# Altium schematic sheet STM 32 F4 sensor_motor.SchDoc
size A3
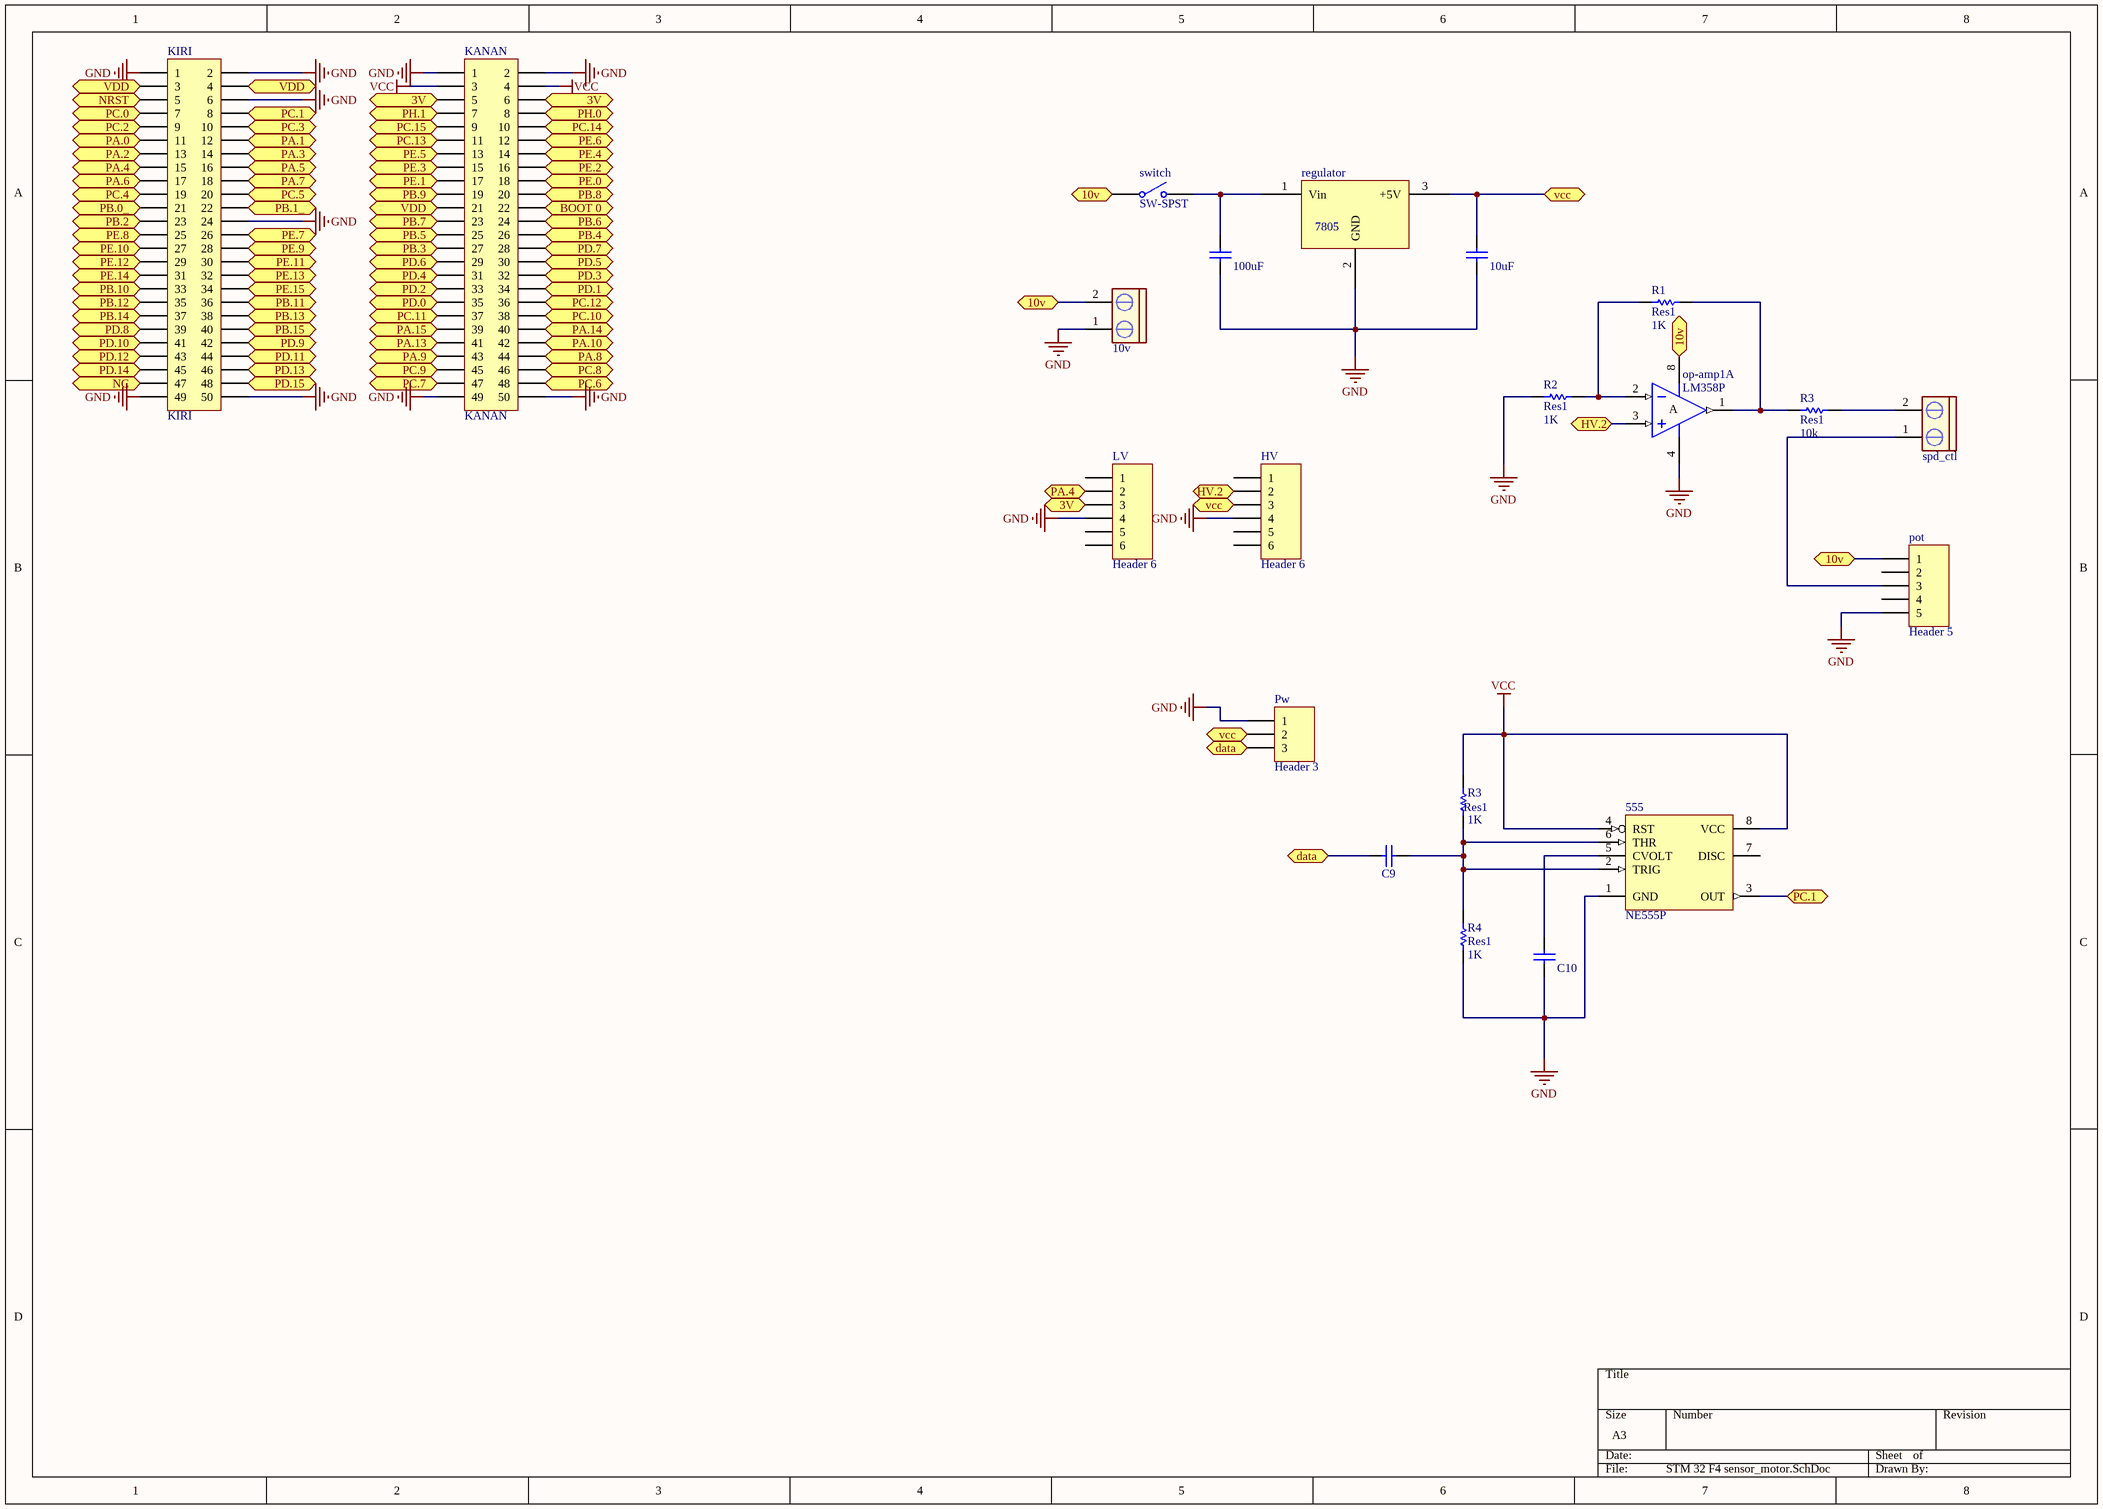
[diagram p0: STM 32 F4 sensor_motor.SchDoc]

## Parts
(Parts that share a designator on the sheet are numbered #1, #2 ... from top to bottom, then left to right.)
10uF  Cap  [My_cap100n]  (value not drawn)
10v  CON2 pin blue  [My_CN2]  (value not drawn)
100uF  Cap  [My_cap100n]  (value not drawn)
555  NE555P  [P008]
C9  Cap  [My_cap100n]  (value not drawn)
C10  Cap  [My_cap100n]  (value not drawn)
HV  Header 6  [HDR1X6]
KANAN  KANAN  [HDR2X25]
KIRI  KIRI  [HDR2X25]
LV  Header 6  [HDR1X6]
op-amp1  LM358P  [P008]  (part A of 2)
pot  Header 5  [HDR1X5]
Pw  Header 3  [HDR1X3]
R1  Res1  value 1K  [AXIAL-0.3]
R2  Res1  value 1K  [AXIAL-0.3]
R3#1  Res1  value 10k  [AXIAL-0.3]
R3#2  Res1  value 1K  [AXIAL-0.3]
R4  Res1  value 1K  [AXIAL-0.3]
regulator  7805  [My_TO-220]
spd_ctl  CON2 pin blue  [My_CN2]  (value not drawn)
switch  SW-SPST  [SPST-2]

## Ports
3V, 10v, BOOT 0, data, HV.2, NC, NRST, PA.0, PA.1, PA.2, PA.3, PA.4, PA.5, PA.6, PA.7, PA.8, PA.9, PA.10, PA.13, PA.14, PA.15, PB.0_, PB.1_, PB.2, PB.3, PB.4, PB.5, PB.6, PB.7, PB.8, PB.9, PB.10, PB.11, PB.12, PB.13, PB.14, PB.15, PC.0, PC.1, PC.2, PC.3, PC.4, PC.5, PC.6, PC.7, PC.8, PC.9, PC.10, PC.11, PC.12, PC.13, PC.14, PC.15, PD.0, PD.1, PD.2, PD.3, PD.4, PD.5, PD.6, PD.7, PD.8, PD.9, PD.10, PD.11, PD.12, PD.13, PD.14, PD.15, PE.0, PE.1, PE.2, PE.3, PE.4, PE.5, PE.6, PE.7, PE.8, PE.9, PE.10, PE.11, PE.12, PE.13, PE.14, PE.15, PH.0, PH.1, vcc, VDD

## Nets
GND: 10uF.1 10v.1 100uF.1 555.1(GND) C10.1 HV.4 KANAN.1 KANAN.2 KANAN.49 KANAN.50 KIRI.1 KIRI.2 KIRI.6 KIRI.24 KIRI.49 KIRI.50 LV.4 op-amp1.4(V-) pot.5 Pw.1 R2.1 R4.1 regulator.2(GND)
VCC: 555.4(RST) 555.8(VCC) KANAN.3 KANAN.4 R3#2.2
3V: KANAN.5 KANAN.6 LV.3 ; port 3V
10v: 10v.2 op-amp1.8(V+) pot.1 switch.1(COMMON) ; port 10v
BOOT 0: KANAN.22 ; port BOOT 0
data: C9.1 Pw.3 ; port data
HV.2: HV.2 op-amp1.3(IN+) ; port HV.2
NC: KIRI.47 ; port NC
NRST: KIRI.5 ; port NRST
PA.0: KIRI.11 ; port PA.0
PA.1: KIRI.12 ; port PA.1
PA.2: KIRI.13 ; port PA.2
PA.3: KIRI.14 ; port PA.3
PA.4: KIRI.15 LV.2 ; port PA.4
PA.5: KIRI.16 ; port PA.5
PA.6: KIRI.17 ; port PA.6
PA.7: KIRI.18 ; port PA.7
PA.8: KANAN.44 ; port PA.8
PA.9: KANAN.43 ; port PA.9
PA.10: KANAN.42 ; port PA.10
PA.13: KANAN.41 ; port PA.13
PA.14: KANAN.40 ; port PA.14
PA.15: KANAN.39 ; port PA.15
PB.0_: KIRI.21 ; port PB.0_
PB.1_: KIRI.22 ; port PB.1_
PB.2: KIRI.23 ; port PB.2
PB.3: KANAN.27 ; port PB.3
PB.4: KANAN.26 ; port PB.4
PB.5: KANAN.25 ; port PB.5
PB.6: KANAN.24 ; port PB.6
PB.7: KANAN.23 ; port PB.7
PB.8: KANAN.20 ; port PB.8
PB.9: KANAN.19 ; port PB.9
PB.10: KIRI.33 ; port PB.10
PB.11: KIRI.36 ; port PB.11
PB.12: KIRI.35 ; port PB.12
PB.13: KIRI.38 ; port PB.13
PB.14: KIRI.37 ; port PB.14
PB.15: KIRI.40 ; port PB.15
PC.0: KIRI.7 ; port PC.0
PC.1: 555.3(OUT) KIRI.8 ; port PC.1
PC.2: KIRI.9 ; port PC.2
PC.3: KIRI.10 ; port PC.3
PC.4: KIRI.19 ; port PC.4
PC.5: KIRI.20 ; port PC.5
PC.6: KANAN.48 ; port PC.6
PC.7: KANAN.47 ; port PC.7
PC.8: KANAN.46 ; port PC.8
PC.9: KANAN.45 ; port PC.9
PC.10: KANAN.38 ; port PC.10
PC.11: KANAN.37 ; port PC.11
PC.12: KANAN.36 ; port PC.12
PC.13: KANAN.11 ; port PC.13
PC.14: KANAN.10 ; port PC.14
PC.15: KANAN.9 ; port PC.15
PD.0: KANAN.35 ; port PD.0
PD.1: KANAN.34 ; port PD.1
PD.2: KANAN.33 ; port PD.2
PD.3: KANAN.32 ; port PD.3
PD.4: KANAN.31 ; port PD.4
PD.5: KANAN.30 ; port PD.5
PD.6: KANAN.29 ; port PD.6
PD.7: KANAN.28 ; port PD.7
PD.8: KIRI.39 ; port PD.8
PD.9: KIRI.42 ; port PD.9
PD.10: KIRI.41 ; port PD.10
PD.11: KIRI.44 ; port PD.11
PD.12: KIRI.43 ; port PD.12
PD.13: KIRI.46 ; port PD.13
PD.14: KIRI.45 ; port PD.14
PD.15: KIRI.48 ; port PD.15
PE.0: KANAN.18 ; port PE.0
PE.1: KANAN.17 ; port PE.1
PE.2: KANAN.16 ; port PE.2
PE.3: KANAN.15 ; port PE.3
PE.4: KANAN.14 ; port PE.4
PE.5: KANAN.13 ; port PE.5
PE.6: KANAN.12 ; port PE.6
PE.7: KIRI.26 ; port PE.7
PE.8: KIRI.25 ; port PE.8
PE.9: KIRI.28 ; port PE.9
PE.10: KIRI.27 ; port PE.10
PE.11: KIRI.30 ; port PE.11
PE.12: KIRI.29 ; port PE.12
PE.13: KIRI.32 ; port PE.13
PE.14: KIRI.31 ; port PE.14
PE.15: KIRI.34 ; port PE.15
PH.0: KANAN.8 ; port PH.0
PH.1: KANAN.7 ; port PH.1
vcc: 10uF.2 HV.3 Pw.2 regulator.3(+5V) ; port vcc  [a separate net that carries the same name]
VDD: KANAN.21 KIRI.3 KIRI.4 ; port VDD
Net100uF_2: 100uF.2 regulator.1(Vin) switch.2(NO)
Net555_2: 555.2(TRIG) 555.6(THR) C9.2 R3#2.1 R4.2
Net555_5: 555.5(CVOLT) C10.2
Netop-amp1_1: op-amp1.1(OUT) R1.2 R3#1.1
Netop-amp1_2: op-amp1.2(IN-) R1.1 R2.2
Netpot_3: pot.3 spd_ctl.1
NetR3#1_2: R3#1.2 spd_ctl.2

Not connected (* = marked no-connect by the designer): 555 7(DISC); HV 1 5 6; LV 1 5 6; pot 2 4

## Notes on the sheet
- (in symbol LM358P, part A) A

## Library data of the parts
10uF 100uF C9 C10 = Cap ceramic: CAP-100Nf; Value: 100nF
10v spd_ctl = CON2 pin blue: Connector blue screw
555 = NE555P: Precision Timer; Published: 16-Jan-2001; LatestRevisionDate: 04-Mar-2005; LatestRevisionNote: Stylized 3D Model Added.; DatasheetVersion: Feb-1992; PackageVersion: Jun-1999; PackageReference: P008; Publisher: Altium Limited; PackageDescription: DIP; 8 Leads; Row Spacing 7.62 mm; Pitch 2.54 mm; Code_JEDEC: MO-001-AN; ComponentLink1Description: Manufacturer Link; ComponentLink1URL: http://www.ti.com/; ComponentLink2Description: Datasheet; ComponentLink2URL: http://www-s.ti.com/sc/ds/ne555.pdf
HV LV = Header 6: Header, 6-Pin; LatestRevisionDate: 17-Jul-2002; LatestRevisionNote: Re-released for DXP Platform.; Publisher: Altium Limited
KANAN KIRI = Header 25X2: Header, 25-Pin, Dual row; LatestRevisionDate: 17-Jul-2002; LatestRevisionNote: Re-released for DXP Platform.; Publisher: Altium Limited
op-amp1 = LM358P: Dual Operational Amplifier; Published: 16-Jan-2001; LatestRevisionDate: 04-Mar-2005; LatestRevisionNote: Stylized 3D Model Added.; DatasheetVersion: Jul-1998; PackageVersion: Jun-1999; PackageReference: P008; Publisher: Altium Limited; PackageDescription: DIP; 8 Leads; Row Spacing 7.62 mm; Pitch 2.54 mm; Code_JEDEC: MO-001-AN; ComponentLink1Description: Manufacturer Link; ComponentLink1URL: http://www.ti.com/; ComponentLink2Description: Datasheet; ComponentLink2URL: http://www-s.ti.com/sc/ds/lm358.pdf
pot = Header 5: Header, 5-Pin; LatestRevisionDate: 17-Jul-2002; LatestRevisionNote: Re-released for DXP Platform.; Publisher: Altium Limited
Pw = Header 3: Header, 3-Pin; LatestRevisionDate: 17-Jul-2002; LatestRevisionNote: Re-released for DXP Platform.; Publisher: Altium Limited
R1 R2 R3#1 R3#2 R4 = Res1: Resistor; Published: 8-Jun-2000; LatestRevisionDate: 17-Jul-2002; LatestRevisionNote: Re-released for DXP Platform.; PackageReference: AXIAL-0.3; Publisher: Altium Limited; PackageDescription: Axial Device, Thru-Hole; 2 Leads; 0.3 in Pin Spacing
regulator = 7805: Regulator
switch = SW-SPST: Single-Pole, Single-Throw Switch; Published: 24-Mar-1999; LatestRevisionDate: 17-Jul-2002; LatestRevisionNote: Re-released for DXP Platform.; PackageReference: SPST-2; Publisher: Altium Limited; PackageDescription: Switch; 2 Leads